# Altium schematic sheet AudioOutput.SchDoc
size Tabloid; DocumentNumber: 8; SheetNumber: 8; SheetTotal: 11; SheetName: Audio output connectors
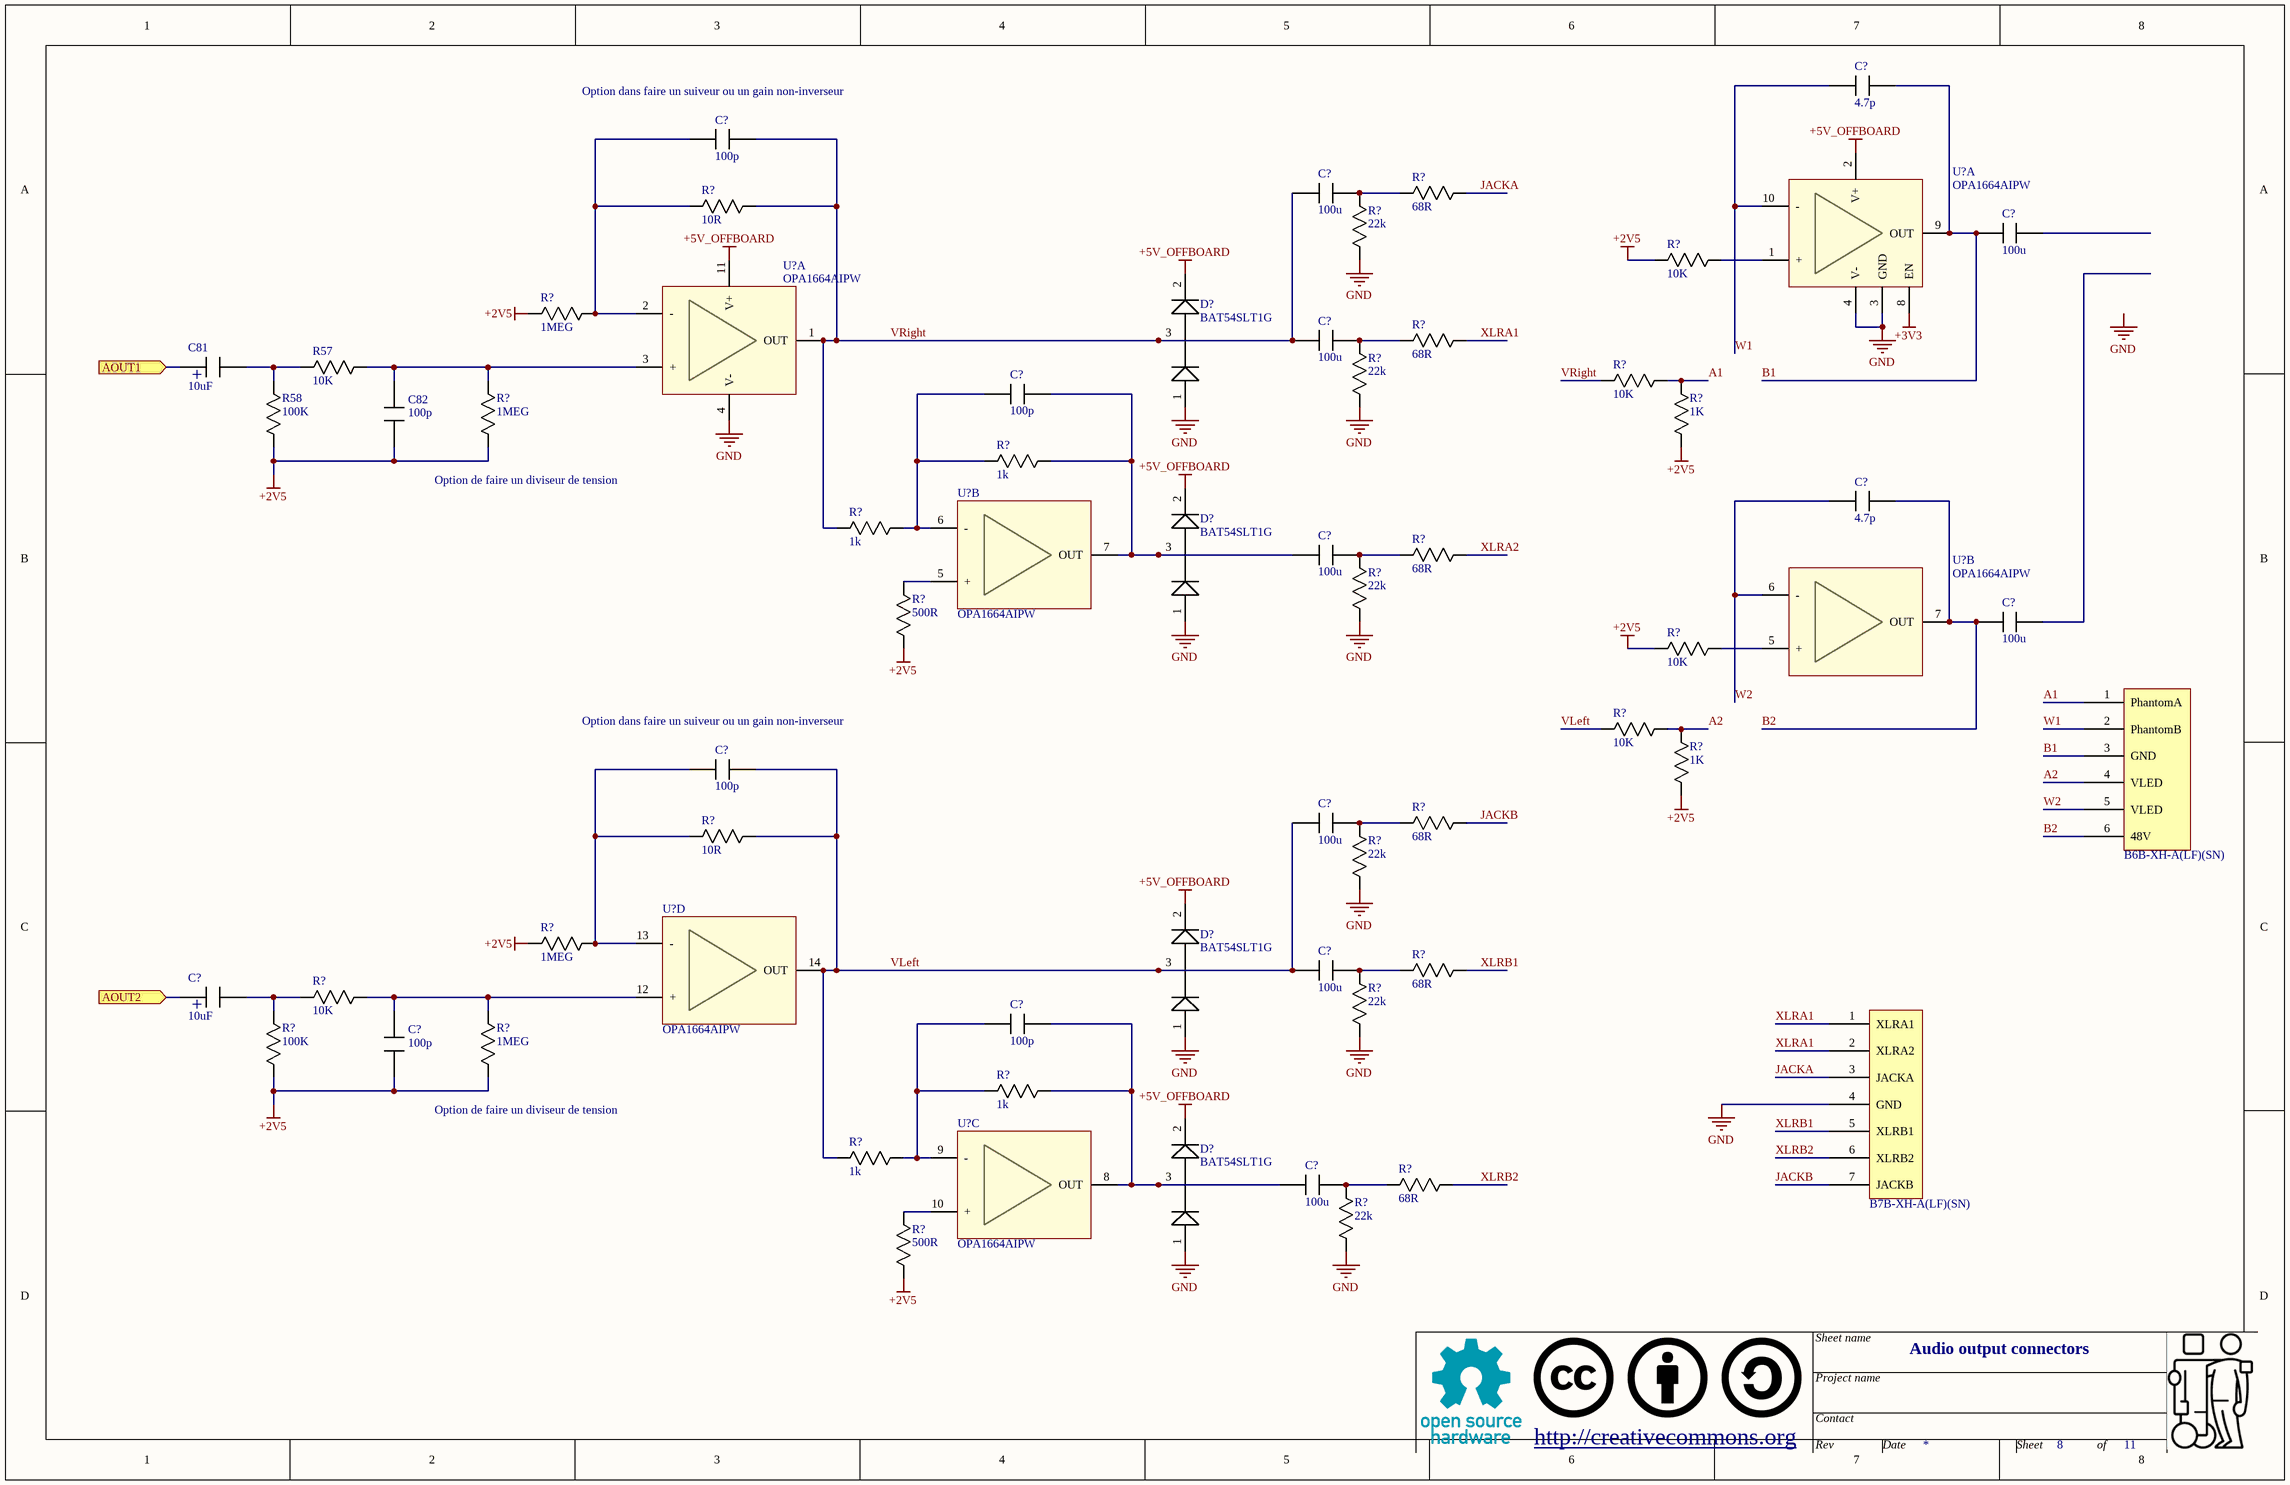
[diagram p0: AudioOutput.SchDoc]

## Parts
(Parts that share a designator on the sheet are numbered #1, #2 ... from top to bottom, then left to right.)
*#1  Mfg_PN: B6B-XH-A(LF)(SN)  (hidden comment: Conn_switch_duo6pins)
*#2  B7B-XH-A(LF)(SN)
C81  value 10uF  [CAP_RAD_SMD_DIA157]  (hidden comment: Capacitor_Polarized)
C82  value 100p  [0603]  (hidden comment: Capacitor)
C?#1  value 4.7p  [0603]  (hidden comment: Capacitor)
C?#2  value 100p  [0603]  (hidden comment: Capacitor)
C?#3  value 100u  [0603]  (hidden comment: Capacitor)
C?#4  value 100u  [0603]  (hidden comment: Capacitor)
C?#5  value 100u  [0603]  (hidden comment: Capacitor)
C?#6  value 100p  [0603]  (hidden comment: Capacitor)
C?#7  value 4.7p  [0603]  (hidden comment: Capacitor)
C?#8  value 100u  [0603]  (hidden comment: Capacitor)
C?#9  value 100u  [0603]  (hidden comment: Capacitor)
C?#10  value 100p  [0603]  (hidden comment: Capacitor)
C?#11  value 100u  [0603]  (hidden comment: Capacitor)
C?#12  value 100u  [0603]  (hidden comment: Capacitor)
C?#13  value 10uF  [CAP_RAD_SMD_DIA157]  (hidden comment: Capacitor_Polarized)
C?#14  value 100p  [0603]  (hidden comment: Capacitor)
C?#15  value 100p  [0603]  (hidden comment: Capacitor)
C?#16  value 100u  [0603]  (hidden comment: Capacitor)
D?#1  Mfg_PN: BAT54SLT1G  [SOT23_132]  (hidden comment: Diode_dual)
D?#2  Mfg_PN: BAT54SLT1G  [SOT23_132]  (hidden comment: Diode_dual)
D?#3  Mfg_PN: BAT54SLT1G  [SOT23_132]  (hidden comment: Diode_dual)
D?#4  Mfg_PN: BAT54SLT1G  [SOT23_132]  (hidden comment: Diode_dual)
R57  value 10K  [0603]  (hidden comment: Resistor)
R58  value 100K  [0603]  (hidden comment: Resistor)
R?#1  value 68R  [0603]  (hidden comment: Resistor)
R?#2  value 10R  [0603]  (hidden comment: Resistor)
R?#3  value 22k  [0603]  (hidden comment: Resistor)
R?#4  value 10K  [0603]  (hidden comment: Resistor)
R?#5  value 1MEG  [0603]  (hidden comment: Resistor)
R?#6  value 68R  [0603]  (hidden comment: Resistor)
R?#7  value 10K  [0603]  (hidden comment: Resistor)
R?#8  value 1K  [0603]  (hidden comment: Resistor)
R?#9  value 22k  [0603]  (hidden comment: Resistor)
R?#10  value 1MEG  [0603]  (hidden comment: Resistor)
R?#11  value 1k  [0603]  (hidden comment: Resistor)
R?#12  value 1k  [0603]  (hidden comment: Resistor)
R?#13  value 68R  [0603]  (hidden comment: Resistor)
R?#14  value 500R  [0603]  (hidden comment: Resistor)
R?#15  value 22k  [0603]  (hidden comment: Resistor)
R?#16  value 10K  [0603]  (hidden comment: Resistor)
R?#17  value 10K  [0603]  (hidden comment: Resistor)
R?#18  value 1K  [0603]  (hidden comment: Resistor)
R?#19  value 68R  [0603]  (hidden comment: Resistor)
R?#20  value 10R  [0603]  (hidden comment: Resistor)
R?#21  value 22k  [0603]  (hidden comment: Resistor)
R?#22  value 1MEG  [0603]  (hidden comment: Resistor)
R?#23  value 68R  [0603]  (hidden comment: Resistor)
R?#24  value 10K  [0603]  (hidden comment: Resistor)
R?#25  value 22k  [0603]  (hidden comment: Resistor)
R?#26  value 100K  [0603]  (hidden comment: Resistor)
R?#27  value 1MEG  [0603]  (hidden comment: Resistor)
R?#28  value 1k  [0603]  (hidden comment: Resistor)
R?#29  value 1k  [0603]  (hidden comment: Resistor)
R?#30  value 68R  [0603]  (hidden comment: Resistor)
R?#31  value 500R  [0603]  (hidden comment: Resistor)
R?#32  value 22k  [0603]  (hidden comment: Resistor)
U?#1  Mfg_PN: OPA1664AIPW  [SOP127P600-8N]  (hidden comment: OPA1622)  (part A of 2)
U?#2  Mfg_PN: OPA1664AIPW  [SOP127P600-8N]  (hidden comment: OPA1664)  (part A of 4)
U?#3  Mfg_PN: OPA1664AIPW  [SOP127P600-8N]  (hidden comment: OPA1664)  (part B of 4)
U?#4  Mfg_PN: OPA1664AIPW  [SOP127P600-8N]  (hidden comment: OPA1622)  (part B of 2)
U?#5  Mfg_PN: OPA1664AIPW  [SOP127P600-8N]  (hidden comment: OPA1664)  (part D of 4)
U?#6  Mfg_PN: OPA1664AIPW  [SOP127P600-8N]  (hidden comment: OPA1664)  (part C of 4)

## Ports
AOUT1 (in), AOUT2 (in)

## Nets
+2V5: C82.2 C?#14.2 R58.1 R?#4.2 R?#5.2 R?#8.2 R?#10.1 R?#14.2 R?#16.2 R?#18.2 R?#22.2 R?#26.1 R?#27.1 R?#31.2
+3V3: U?#1.8(EN)
+5V_OFFBOARD: D?#1.2(K) D?#2.2(K) D?#3.2(K) D?#4.2(K) U?#1.2(V+) U?#2.11(V+)
GND: *#2.4(GND) D?#1.1(K) D?#2.1(K) D?#3.1(K) D?#4.1(K) R?#3.1 R?#9.1 R?#15.1 R?#21.1 R?#25.1 R?#32.1 U?#1.3(GND) U?#1.4(V-) U?#2.4(V-)
A1: *#1.1(PhantomA) R?#7.1 R?#8.1
A2: *#1.4(VLED) R?#17.1 R?#18.1
AOUT1: C81.+ ; port AOUT1
AOUT2: C?#13.+ ; port AOUT2
B1: *#1.3(GND) C?#1.2 C?#4.1 U?#1.9(OUT)
B2: *#1.6(48V) C?#7.2 C?#9.1 U?#4.7(OUT)
JACKA: *#2.3(JACKA) R?#1.1
JACKB: *#2.7(JACKB) R?#19.1
VLeft: C?#10.2 C?#11.1 C?#12.1 D?#3.3(AK) R?#17.2 R?#20.1 R?#29.2 U?#5.14(OUT)
VRight: C?#2.2 C?#3.1 C?#5.1 D?#1.3(AK) R?#2.1 R?#7.2 R?#12.2 U?#2.1(OUT)
W1: *#1.2(PhantomB) C?#1.1 U?#1.10(-)
W2: *#1.5(VLED) C?#7.1 U?#4.6(-)
XLRA1: *#2.1(XLRA1) *#2.2(XLRA2) R?#6.1
XLRA2: R?#13.1
XLRB1: *#2.5(XLRB1) R?#23.1
XLRB2: *#2.6(XLRB2) R?#30.1
NetC81_-: C81.- R57.1 R58.2
NetC82_1: C82.1 R57.2 R?#10.2 U?#2.3(+)
NetC?#2_1: C?#2.1 R?#2.2 R?#5.1 U?#2.2(-)
NetC?#3_2: C?#3.2 R?#1.2 R?#3.2
NetC?#5_2: C?#5.2 R?#6.2 R?#9.2
NetC?#6_1: C?#6.1 R?#11.2 R?#12.1 U?#3.6(-)
NetC?#6_2: C?#6.2 C?#8.1 D?#2.3(AK) R?#11.1 U?#3.7(OUT)
NetC?#8_2: C?#8.2 R?#13.2 R?#15.2
NetC?#10_1: C?#10.1 R?#20.2 R?#22.1 U?#5.13(-)
NetC?#11_2: C?#11.2 R?#19.2 R?#21.2
NetC?#12_2: C?#12.2 R?#23.2 R?#25.2
NetC?#13_-: C?#13.- R?#24.1 R?#26.2
NetC?#14_1: C?#14.1 R?#24.2 R?#27.2 U?#5.12(+)
NetC?#15_1: C?#15.1 R?#28.2 R?#29.1 U?#6.9(-)
NetC?#15_2: C?#15.2 C?#16.1 D?#4.3(AK) R?#28.1 U?#6.8(OUT)
NetC?#16_2: C?#16.2 R?#30.2 R?#32.2
NetR?#4_1: R?#4.1 U?#1.1(+)
NetR?#14_1: R?#14.1 U?#3.5(+)
NetR?#16_1: R?#16.1 U?#4.5(+)
NetR?#31_1: R?#31.1 U?#6.10(+)

Not connected (* = marked no-connect by the designer): C?#4 2; C?#9 2

## Notes on the sheet
- (near C?#2) Option dans faire un suiveur ou un gain non-inverseur
- (near R?#10) Option de faire un diviseur de tension
- (near C?#10) Option dans faire un suiveur ou un gain non-inverseur
- (near R?#27) Option de faire un diviseur de tension
- Labels drawn without touching a wire or pin: GND
- Sheet name
- http://creativecommons.org
- Project name
- Contact
- Rev
- Date
- Sheet
- of

## Library data of the parts
*#1 = Conn_switch_duo6pins: Mfg: JST Sales America Inc.; Supplier1: Digikey; Supplier1_PN: 455-2271-ND
*#2 = Conn_audioIN_duo7pins: Mfg: JST Sales America Inc.; Supplier1: Digikey; Supplier1_PN: 455-2271-ND
C81 C?#13 = Capacitor_Polarized: Capacitor; Mfg: Nichicon; Mfg_PN: UWX1C100MCL1GB; HelpURL: *; NI: *; Supplier1: Digikey; Supplier1_PN: 493-2100-1-ND; Tolerance: *; Type: *; Rating: *
C82 C?#1-C?#12 C?#14-C?#16 = Capacitor: Mfg: Murata; Mfg_PN: GRM1885C1H222JA01D; HelpURL: *; NI: *; Supplier1: Digikey; Supplier1_PN: 490-1459-1-ND; Tolerance: *; Type: *; Rating: *
D?#1-D?#4 = Diode_dual: Diode; Mfg: Onsemi; HelpURL: *; NI: *; Supplier1: Digikey; Supplier1_PN: BAT54SLT1GOSCT-ND; Tolerance: *; Type: *; Rating: *; Value: *
R57 R?#24 = Resistor: Mfg: Yageo; Mfg_PN: RC0603JR-07470RL; HelpURL: *; NI: *; Supplier1: Digikey; Supplier1_PN: 311-470GRCT-ND; Type: *; Rating: *; Tolerance: *
R58 R?#1-R?#23 R?#25-R?#32 = Resistor: Mfg: Yageo; Mfg_PN: 311-10GRCT-ND; HelpURL: *; NI: *; Supplier1: Digikey; Supplier1_PN: 311-100KGRCT-ND; Type: *; Rating: *; Tolerance: *
U?#1 U?#4 = OPA1622: Dual amplifier (headphone driver); Mfg: Texas Instruments; HelpURL: *; NI: *; Rating: *; Supplier1: Digikey; Supplier1_PN: 296-34981-ND; Tolerance: *; Value: *
U?#2 U?#3 U?#5 U?#6 = OPA1664: Quad amplifier (audio); Mfg: Texas Instruments; HelpURL: *; NI: *; Rating: *; Supplier1: Digikey; Supplier1_PN: 296-34981-ND; Tolerance: *; Value: *